# EAGLE schematic SolderingStation (EAGLE 6.1)
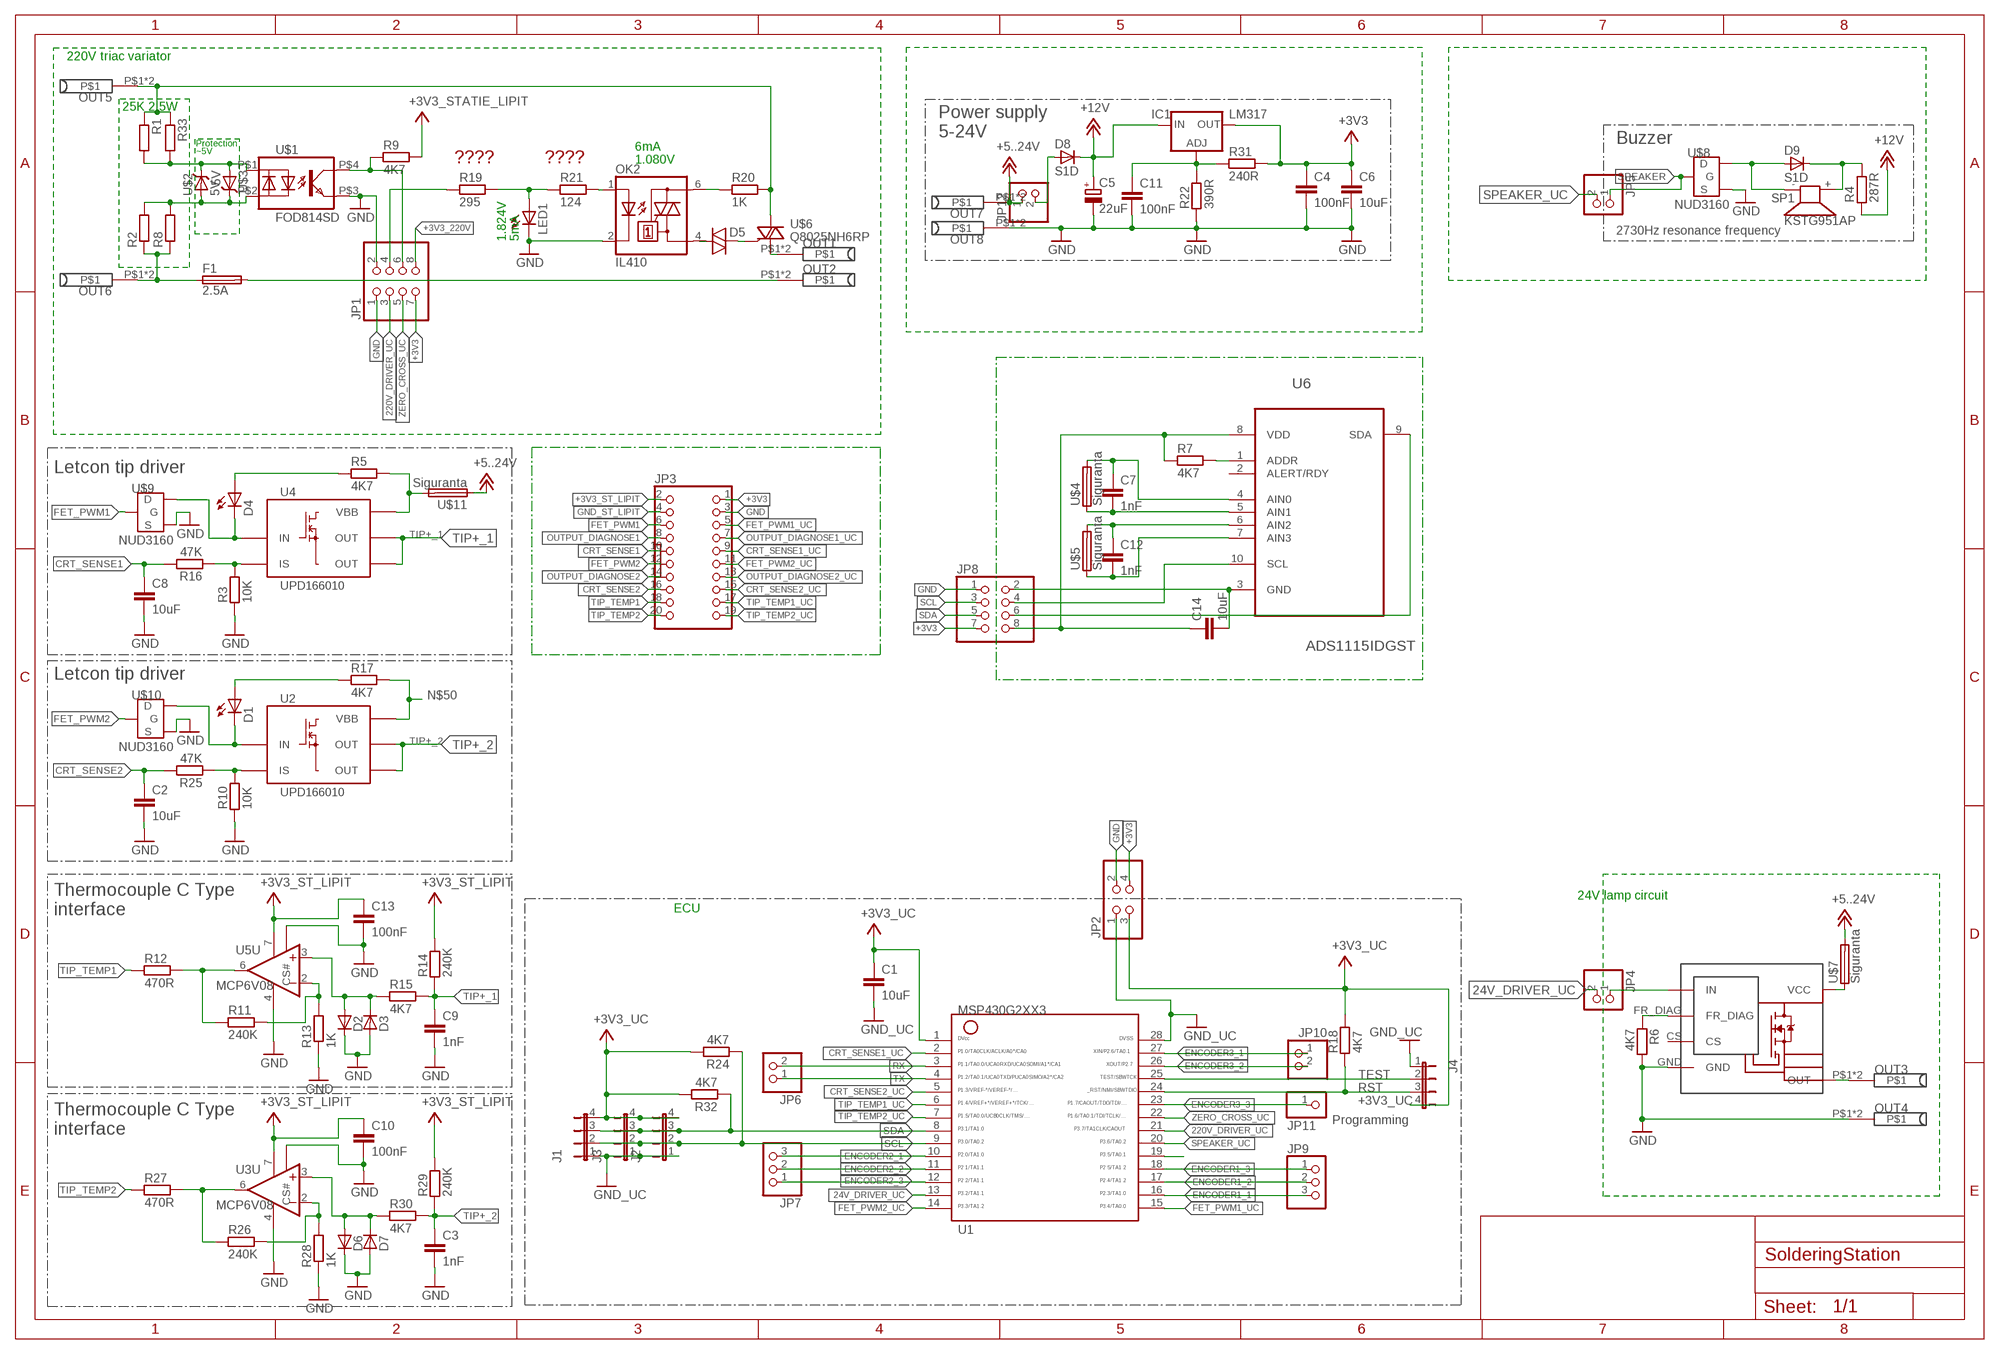
[diagram p0: schematic, sheet 1]

## Parts
C1  10uF  C1206  [1206]
C2  10uF  C1206  [1206]
C3  1nF  C0805  [0805]
C4  100nF  C1206  [1206]
C5  22uF  C_ELECTROLYTIC2  [C_EL_6.3X5.4]
C6  10uF  C1206  [1206]
C7  1nF  C0805  [0805]
C8  10uF  C1206  [1206]
C9  1nF  C0805  [0805]
C10  100nF  C0805  [0805]
C11  100nF  C1206  [1206]
C12  1nF  C0805  [0805]
C13  100nF  C0805  [0805]
C14  10uF  C0805  [0805]
CLH1  VN7004  [OCTAPAK]
D1  LED3MM  [LED_3MM]
D2  DIODESOT23  [SOT23]
D3  DIODESOT23  [SOT23]
D4  LED3MM  [LED_3MM]
D5  DIAC-DO35-10  [DO35-10]
D6  DIODESOT23  [SOT23]
D7  DIODESOT23  [SOT23]
D8  S1D  DIODES1D  [S1D]
D9  S1D  DIODES1D  [S1D]
F1  2.5A  GSH15  [GSH15]
IC1  LM317  LM317MABDT  [DPACK]
J1  JP4  [JP4]
J2  JP4  [JP4]
J3  JP4  [JP4]
J4  JP4  [JP4]
JP1  PINHD-2X4  [2X04]
JP2  PINHD-2X2  [2X02]
JP3  PINHD-2X10  [2X10]
JP4  PINHD-1X2  [1X02]
JP5  PINHD-1X2  [1X02]
JP6  PINHD-1X2  [1X02]
JP7  PINHD-1X3  [1X03]
JP8  PINHD-2X4  [2X04]
JP9  PINHD-1X3  [1X03]
JP10  PINHD-1X2  [1X02]
JP11  PINHD-1X1  [1X01]
JP12  PINHD-1X2  [1X02]
LED1  LEDCHIPLED_0603  [CHIPLED_0603]
OK2  IL410  [DIL06]
OUT1  BANANA  [BANANA]
OUT2  BANANA  [BANANA]
OUT3  BANANA  [BANANA]
OUT4  BANANA  [BANANA]
OUT5  BANANA  [BANANA]
OUT6  BANANA  [BANANA]
OUT7  BANANA  [BANANA]
OUT8  BANANA  [BANANA]
R1  RESISTOR-PTH-0.4  [RTH025W]
R2  RESISTOR-PTH-0.4  [RTH025W]
R3  10K  R0805  [0805]
R4  287R  R1206  [1206]
R5  4K7  R0805  [0805]
R6  4K7  R0805  [0805]
R7  4K7  R0805  [0805]
R8  RESISTOR-PTH-0.4  [RTH025W]
R9  4K7  R1206  [1206]
R10  10K  R0805  [0805]
R11  240K  R0805  [0805]
R12  470R  R0805  [0805]
R13  1K  R0805  [0805]
R14  240K  R0805  [0805]
R15  4K7  R0805  [0805]
R16  47K  R0805  [0805]
R17  4K7  R0805  [0805]
R18  4K7  R0805  [0805]
R19  295  R1206  [1206]
R20  1K  R1206  [1206]
R21  124  R1206  [1206]
R22  390R  R0805  [0805]
R24  4K7  R0805  [0805]
R25  47K  R0805  [0805]
R26  240K  R0805  [0805]
R27  470R  R0805  [0805]
R28  1K  R0805  [0805]
R29  240K  R0805  [0805]
R30  4K7  R0805  [0805]
R31  240R  R0805  [0805]
R32  4K7  R0805  [0805]
R33  RESISTOR-PTH-0.4  [RTH025W]
SP1  KSTG951AP  [KSTG951AP]
U1  MSP340G2443  G2XX3---PW28  [PW28]
U2  UPD166010  [TO252-51]
U3  MCP6V08  MCP6V08SN  [SO08]
U4  UPD166010  [TO252-51]
U5  MCP6V08  MCP6V08SN  [SO08]
U6  ADS1115IDGST  [SOP50P490X110-10N]
U$1  FOD814SD  [DIP_4PIN]
U$2  5V  ZENER  [ZENER]
U$3  5V  ZENER  [ZENER]
U$4  Siguranta  SOCLU_THERMOCOUPLE  [SOCLU_THERMOCOUPLE]
U$5  Siguranta  SOCLU_THERMOCOUPLE  [SOCLU_THERMOCOUPLE]
U$6  Q8025NH6RP  [TO-263]
U$7  Siguranta  SOCLU_THERMOCOUPLE  [SOCLU_THERMOCOUPLE]
U$8  NUD3160  [SOT23]
U$9  NUD3160  [SOT23]
U$10  NUD3160  [SOT23]
U$11  Siguranta  SOCLU_THERMOCOUPLE  [SOCLU_THERMOCOUPLE]

## Nets
24V_DRIVER_UC: JP4.2 U1.13
220V_DRIVER_UC: JP1.3 U1.21
+3V3: C4.1 C6.1 IC1.4(OUT) J1.4 J2.4 J3.4 JP1.7 JP2.4 JP3.1 JP8.7 R24.2 R31.2 R32.2 ; supply symbol labelled +3V3_UC
+3V3_220V: JP1.8 R9.2 ; supply symbol labelled +3V3_STATIE_LIPIT
+3V3_CONTROLLER: C1.1 U1.1 ; supply symbol labelled +3V3_UC
+3V3_ST_LIPIT: C10.1 C13.1 JP3.2 R14.2 R29.2 U3.7(U:V+) U5.7(U:V+)
+3V3_UC: J4.4 JP2.3 R18.2
+12V: C5.+ D8.C IC1.3(IN) R4.1
+15V: JP12.1 OUT7.P$1 OUT7.P$2 U$7.1B U$7.2B U$11.1A U$11.2A ; supply symbol labelled +5..24V
CRT_SENSE1: C8.1 JP3.10 R16.2
CRT_SENSE1_UC: JP3.9 U1.2
CRT_SENSE2: C2.1 JP3.16 R25.2
CRT_SENSE2_UC: JP3.15 U1.5
ENCODER1_1: JP9.3 U1.16
ENCODER1_2: JP9.2 U1.17
ENCODER1_3: JP9.1 U1.18
ENCODER2_1: JP7.3 U1.10
ENCODER2_2: JP7.2 U1.11
ENCODER2_3: JP7.1 U1.12
ENCODER3_1: JP10.1 U1.27
ENCODER3_2: JP10.2 U1.26
ENCODER3_3: JP11.1 U1.23
FET_PWM1: JP3.6 U$9.1(G)
FET_PWM1_UC: JP3.5 U1.15
FET_PWM2: JP3.12 U$10.1(G)
FET_PWM2_UC: JP3.11 U1.14
GND: C4.2 C5.- C6.2 C11.2 CLH1.GND J1.1 J2.1 J3.1 JP1.1 JP2.2 JP3.3 JP8.1 OUT4.P$1 OUT4.P$2 OUT8.P$1 OUT8.P$2 R6.2 R22.1 U$8.2(S) ; supply symbol labelled GND_UC
GND_220V: JP1.2 LED1.C OK2.2(C) U$1.P$3(EMIT) ; supply symbol labelled GND
GND_ST_LIPIT: C2.2 C3.2 C8.2 C9.2 C10.2 C13.2 D2.3(C) D3.1(A) D6.3(C) D7.1(A) JP3.4 R3.1 R10.1 R13.1 R28.1 U3.4(U:V-) U3.8(CS#) U5.4(U:V-) U5.8(CS#) U$9.2(S) U$10.2(S) ; supply symbol labelled GND
GND_UC: C1.2 J4.1 JP2.1 U1.28
N$2: D1.K(C) U2.2(IN) U$10.3(D)
N$3: D4.A R5.1
N$4: D1.A R17.1
N$5: D9.A SP1.- U$8.3(D)
N$7: D4.K(C) U4.2(IN) U$9.3(D)
N$8: R10.2 R25.1 U2.4(IS)
N$9: R26.1 R27.2 U3.6(U:OUT)
N$10: D6.1(A) D7.3(C) R30.1 U3.3(U:+IN)
N$11: R26.2 R28.2 U3.2(U:-IN)
N$12: OK2.6(A2) R20.1
N$13: D5.A OK2.4(A1)
N$14: OK2.1(A) R21.2
N$15: JP1.4 R19.1
N$16: CLH1.VCC U$7.1A U$7.2A
N$17: LED1.A R19.2 R21.1
N$18: D5.C U$6.G
N$19: D9.C R4.2 SP1.+
N$20: CLH1.FR_DIAG R6.1
N$21: F1.1 OUT6.P$1 OUT6.P$2 R2.1 R8.1
N$26: CLH1.INPUT(IN) JP4.1
N$27: R3.2 R16.1 U4.4(IS)
N$29: R11.1 R12.2 U5.6(U:OUT)
N$30: R1.2 R33.2 U$1.P$1(ANODE) U$2.K U$3.A
N$31: D2.1(A) D3.3(C) R15.1 U5.3(U:+IN)
N$32: R2.2 R8.2 U$1.P$2(CATHODE) U$2.A U$3.K
N$34: R11.2 R13.2 U5.2(U:-IN)
N$35: CLH1.OUTPUT1(OUT) CLH1.OUTPUT2(OUT) CLH1.OUTPUT3(OUT) OUT3.P$1 OUT3.P$2
N$36: JP1.6 R9.1 U$1.P$4(COL)
N$37: C14.2 JP8.2 U6.3(GND)
N$38: R7.2 U6.1(ADDR)
N$39: C14.1 JP8.8 R7.1 U6.8(VDD)
N$40: C7.1 U6.4(AIN0) U$4.1B U$4.2B
N$41: C7.2 U6.5(AIN1) U$4.1A U$4.2A
N$42: C11.1 IC1.1(ADJ) R22.2 R31.1
N$43: C12.1 U6.6(AIN2) U$5.1B U$5.2B
N$44: C12.2 U6.7(AIN3) U$5.1A U$5.2A
N$45: JP8.4 U6.10(SCL)
N$46: JP8.6 U6.9(SDA)
N$50: R5.2 R17.2 U2.TAB(VBB) U4.TAB(VBB) U$11.1B U$11.2B
N$51: D8.A JP12.2
OUTPUT_DIAGNOSE1: JP3.8
OUTPUT_DIAGNOSE1_UC: JP3.7
OUTPUT_DIAGNOSE2: JP3.14
OUTPUT_DIAGNOSE2_UC: JP3.13
RST: J4.3 R18.1 U1.24
RX: JP6.2 U1.3
SCL: J1.2 J2.2 J3.2 JP8.3 R24.1 U1.9
SDA: J1.3 J2.3 J3.3 JP8.5 R32.1 U1.8
SEGMENT_D: U1.19
SPEAKER: JP5.1 U$8.1(G)
SPEAKER_UC: JP5.2 U1.20
TEST: J4.2 U1.25
TIP+_1: C9.1 R14.1 R15.2 U4.1(OUT) U4.5(OUT)
TIP+_2: C3.1 R29.1 R30.2 U2.1(OUT) U2.5(OUT)
TIP_TEMP1: JP3.18 R12.1
TIP_TEMP1_UC: JP3.17 U1.6
TIP_TEMP2: JP3.20 R27.1
TIP_TEMP2_UC: JP3.19 U1.7
TX: JP6.1 U1.4
ZERO_CROSS_UC: JP1.5 U1.22
~+OUT: F1.2 OUT2.P$1 OUT2.P$2
~-OUT: OUT1.P$1 OUT1.P$2 U$6.T1
~IN1: OUT5.P$1 OUT5.P$2 R1.1 R20.2 R33.1 U$6.T2
Unconnected: CLH1.CS U6.2(ALERT/RDY)

## Notes on the sheet
- 220V triac variator
- 25K 2.5W
- Power supply
- 5-24V
- Protection | Buzzer
- 6mA
- ~5V
- ???? | ???? | 1.080V
- 2730Hz resonance frequency
- 1.824V | 5mA
- Letcon tip driver
- Letcon tip driver
- Thermocouple C Type | 24V lamp circuit
- interface | ECU
- Thermocouple C Type
- Programming
- interface

## Library data of the parts
C1-C3 C7-C10 C12 C13 = adi_v1.2:C: SMD capacitor 0603 0805 1206
C4 C6 C11 C14 = ATE:C: SMD capacitor 0603 0805 1206
C5 = adi_v1.4:C_ELECTROLYTIC: Electrolytic capacitor 8x10mm 6.3x5.4mm
CLH1 = Serghei IR station:VN7004
D1 D4 = adi_v1.4:LED: LED OSRAM: - CHIPLED LG R971, LG N971, LY N971, LG Q971, LY Q971, LO R971, LY R971 LH N974, LH R974 LS Q976, LO Q976, LY Q976 LO Q996 - Hyper CHIPLED LW Q18S LB Q993, LB Q99A, LB R99A - SideLED LS A670, LO A670, LY A670, LG A670, LP A670 LB A673, LV A673, LT A673, LW A673 LH A674 LY A675 LS A676, LA A676, LO A676, LY A676, LW A676 LS A679, LY A679, LG A679 - Hyper Micro SIDELED® LS Y876, LA Y876, LO Y876, LY Y876 LT Y87S - SmartLED LW L88C, LW L88S LB L89C, LB L89S, LG L890 LS L89K, LO L89K, LY L89K LS L896, LA L896, LO L896, LY L896 - TOPLED LS T670, LO T670, LY T670, LG T670, LP T670 LSG T670, LSP T670, LSY T670, LOP T670, LYG T670 LG T671, LOG T671, LSG T671 LB T673, LV T673, LT T673, LW T673 LH T674 LS T676, LA T676, LO T676, LY T676, LB T676, LH T676, LSB T676, LW T676 LB T67C, LV T67C, LT T67C, LS T67K, LO T67K, LY T67K, LW E67C LS E67B, LA E67B, LO E67B, LY E67B, LB E67C, LV E67C, LT E67C LW T67C LS T679, LY T679, LG T679 LS T770, LO T770, LY T770, LG T770, LP T770 LB T773, LV T773, LT T773, LW T773 LH T774 LS E675, LA E675, LY E675, LS T675 LS T776, LA T776, LO T776, LY T776, LB T776 LHGB T686 LT T68C, LB T68C - Hyper Mini TOPLED® LB M676 - Mini TOPLED Santana® LG M470 LS M47K, LO M47K, LY M47K Source: http://www.osram.convergy.de LUXEON: - LUMILED® LXK2-PW12-R00, LXK2-PW12-S00, LXK2-PW14-U00, LXK2-PW14-V00 LXK2-PM12-R00, LXK2-PM12-S00, LXK2-PM14-U00 LXK2-PE12-Q00, LXK2-PE12-R00, LXK2-PE12-S00, LXK2-PE14-T00, LXK2-PE14-U00 LXK2-PB12-K00, LXK2-PB12-L00, LXK2-PB12-M00, LXK2-PB14-N00, LXK2-PB14-P00, LXK2-PB14-Q00 LXK2-PR12-L00, LXK2-PR12-M00, LXK2-PR14-Q00, LXK2-PR14-R00 LXK2-PD12-Q00, LXK2-PD12-R00, LXK2-PD12-S00 LXK2-PH12-R00, LXK2-PH12-S00 LXK2-PL12-P00, LXK2-PL12-Q00, LXK2-PL12-R00 Source: www.luxeon.com KINGBRIGHT: KA-3528ASYC Source: www.kingbright.com
D2 D3 D6-D8 = adi_v1.3:DIODE: Generic Diode
D5 = diode:DIAC-: DIAC
D9 = adi_v1.4:DIODE: Generic Diode
F1 = fuse:GSH15: FUSE HOLDER grid 15mm, 19649 Wickmann; MPN: 64900001039; OC_FARNELL: 1271673; OC_NEWARK: 02P0318
IC1 = v-reg:LM317?*: 500 mA Adjustable Output Positive Voltage Regulator Source: http://www.onsemi.co.jp .. LM317M-D.PDF
J1-J4 = adi_v1.4:JP4
JP1 JP8 = adafruit1:PINHD-2X4: PIN HEADER
JP2 = pinhead:PINHD-2X2: PIN HEADER
JP3 = H_bridge_library:PINHD-2X10: PIN HEADER
JP4-JP6 JP10 JP12 = pinhead:PINHD-1X2: PIN HEADER
JP7 JP9 = adafruit1:PINHD-1X3: PIN HEADER
JP11 = adafruit:PINHD-1X1: Pin header 1x1 for 0.1" spacing With round pins
LED1 = led:LED: LED OSRAM: - CHIPLED LG R971, LG N971, LY N971, LG Q971, LY Q971, LO R971, LY R971 LH N974, LH R974 LS Q976, LO Q976, LY Q976 LO Q996 - Hyper CHIPLED LW Q18S LB Q993, LB Q99A, LB R99A - SideLED LS A670, LO A670, LY A670, LG A670, LP A670 LB A673, LV A673, LT A673, LW A673 LH A674 LY A675 LS A676, LA A676, LO A676, LY A676, LW A676 LS A679, LY A679, LG A679 - Hyper Micro SIDELED® LS Y876, LA Y876, LO Y876, LY Y876 LT Y87S - SmartLED LW L88C, LW L88S LB L89C, LB L89S, LG L890 LS L89K, LO L89K, LY L89K LS L896, LA L896, LO L896, LY L896 - TOPLED LS T670, LO T670, LY T670, LG T670, LP T670 LSG T670, LSP T670, LSY T670, LOP T670, LYG T670 LG T671, LOG T671, LSG T671 LB T673, LV T673, LT T673, LW T673 LH T674 LS T676, LA T676, LO T676, LY T676, LB T676, LH T676, LSB T676, LW T676 LB T67C, LV T67C, LT T67C, LS T67K, LO T67K, LY T67K, LW E67C LS E67B, LA E67B, LO E67B, LY E67B, LB E67C, LV E67C, LT E67C LW T67C LS T679, LY T679, LG T679 LS T770, LO T770, LY T770, LG T770, LP T770 LB T773, LV T773, LT T773, LW T773 LH T774 LS E675, LA E675, LY E675, LS T675 LS T776, LA T776, LO T776, LY T776, LB T776 LHGB T686 LT T68C, LB T68C - Hyper Mini TOPLED® LB M676 - Mini TOPLED Santana® LG M470 LS M47K, LO M47K, LY M47K Source: http://www.osram.convergy.de LUXEON: - LUMILED® LXK2-PW12-R00, LXK2-PW12-S00, LXK2-PW14-U00, LXK2-PW14-V00 LXK2-PM12-R00, LXK2-PM12-S00, LXK2-PM14-U00 LXK2-PE12-Q00, LXK2-PE12-R00, LXK2-PE12-S00, LXK2-PE14-T00, LXK2-PE14-U00 LXK2-PB12-K00, LXK2-PB12-L00, LXK2-PB12-M00, LXK2-PB14-N00, LXK2-PB14-P00, LXK2-PB14-Q00 LXK2-PR12-L00, LXK2-PR12-M00, LXK2-PR14-Q00, LXK2-PR14-R00 LXK2-PD12-Q00, LXK2-PD12-R00, LXK2-PD12-S00 LXK2-PH12-R00, LXK2-PH12-S00 LXK2-PL12-P00, LXK2-PL12-Q00, LXK2-PL12-R00 Source: www.luxeon.com KINGBRIGHT: KA-3528ASYC Source: www.kingbright.com
OK2 = optocoupler:IL410: SIEMENS OPTO COUPLER; MF: VISHAY/TELEFUNKEN; MPN: IL410; OC_FARNELL: 1045434; OC_NEWARK: 58K1715
OUT1-OUT8 = H_bridge_library:BANANA
R1 R2 R8 R33 = dp_devices:RESISTOR
R3-R7 R10-R18 R22 R24-R32 = adi_v1.2:R
R9 R19-R21 = H_bridge_library:R
SP1 = adi_v1.4:KSTG951AP: SPEAKER Source: Schukat; OC_FARNELL: http://ro.farnell.com/kingstate/kstg951ap/buzzer-magnetic-pin-85db-5v/dp/2215078?Ntt=KSTG951AP; OC_NEWARK: unknown
U1 = adi_v1.3:G2XX3---PW28: MSP430G2XX1 TSSOP (PW) 28 Pin Package
U2 U4 = adi_v1.3:UPD166010
U3 U5 = adi_v1.3:MCP6V08: Single Op Amp 2.7V to 6.0V Single Supply CMOS Source: http://ww1.microchip.com/downloads/en/DeviceDoc/21314g.pdf
U6 = Texas Instruments_By_element14_Batch_1:ADS1115IDGST: Analog-to-Digital Converter with Internal Reference; MPN: ADS1115IDGST; OC_FARNELL: 1762981; OC_NEWARK: 25R1241; PACKAGE: MSOP-10; SUPPLIER: Texas Instruments
U$1 = Serghei IR station:FOD814SD
U$2 U$3 = adi_v1.6:ZENER: Zener diode - Farnell <http://ro.farnell.com/vishay-semiconductor/1n5231b/diode-zener-5-1v-0-5w/dp/1612371> 1N5231B DIODE, ZENER, 5.1V, 0.5W Diode Case Style:DO-35 Forward Current If(AV):200mA Termination Type:Axial Leaded
U$4 U$5 U$7 U$11 = Serghei IR station:SOCLU_THERMOCOUPLE
U$6 = Serghei IR station:Q8025NH6RP
U$8-U$10 = adi_v1.4:NUD3160